# Altium schematic sheet MCU.SchDoc
size A4; SheetNumber: 3; SheetTotal: 6
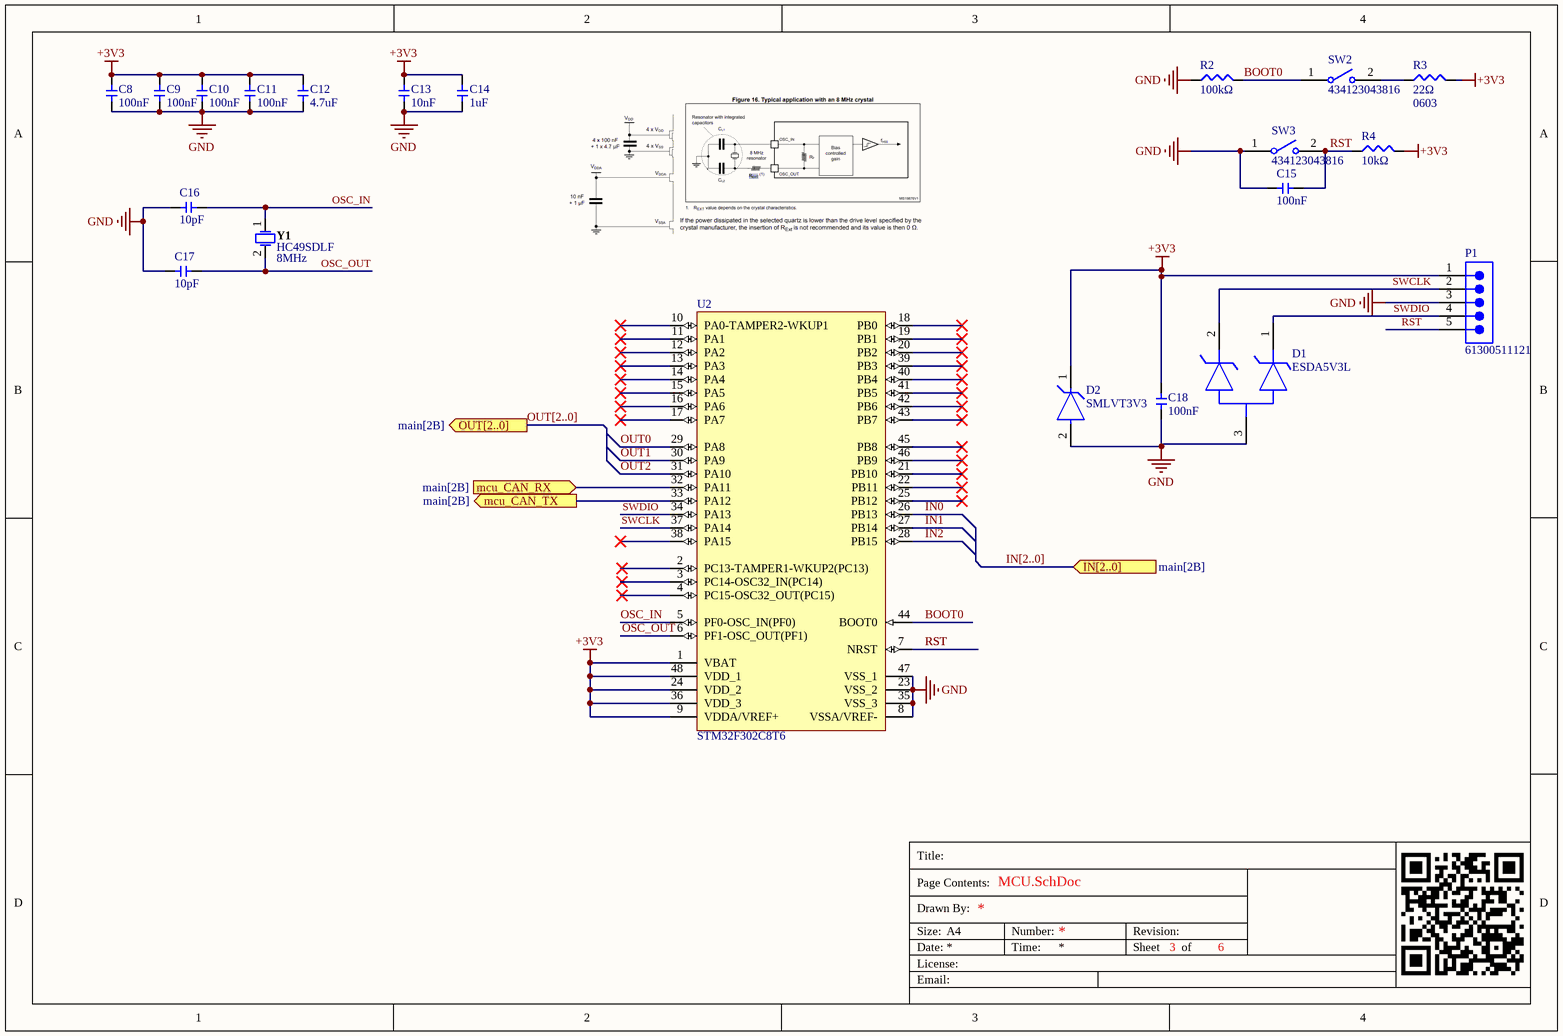
[diagram p0: MCU.SchDoc]

## Parts
C8  value 100nF  [0603_cap]  (hidden comment: 0603_100nF)
C9  value 100nF  [0603_cap]  (hidden comment: 0603_100nF)
C10  value 100nF  [0603_cap]  (hidden comment: 0603_100nF)
C11  value 100nF  [0603_cap]  (hidden comment: 0603_100nF)
C12  value 4.7uF  [0603_cap]  (hidden comment: 0603_4.7uF)
C13  value 10nF  [0603_cap]  (hidden comment: 0603_10nF)
C14  value 1uF  [0603_cap]  (hidden comment: 0603_1uF)
C15  value 100nF  [0603_cap]  (hidden comment: 0603_100nF)
C16  value 10pF  [0603_cap]  (hidden comment: 0603_10pF)
C17  value 10pF  [0603_cap]  (hidden comment: 0603_10pF)
C18  value 100nF  [0603_cap]  (hidden comment: 0603_100nF)
D1  ESDA5V3L  [FP-SOT23-3L-0053390-MFG]
D2  SMLVT3V3  [FP-SMB-MFG]
P1  61300511121  [61300511121]
R2  value 100kΩ  [0603-smd]  (hidden comment: 0603_100K)
R3  value 22Ω  Package: 0603  [0603-smd]  (hidden comment: 0603_22R)
R4  value 10kΩ  [0603-smd]  (hidden comment: 0603_10K)
SW2  434123043816  [WS-TASV_L6W3.5H4.3_4341x30438x6]
SW3  434123043816  [WS-TASV_L6W3.5H4.3_4341x30438x6]
U2  STM32F302C8T6  [STM-LQFP48_L]
Y1  Package Reference: HC49SDLF  Frequency: 8MHz  [FOX-HC49SDLF_V]  (hidden comment: FOXSDLF/080-20)

## Ports
IN[2..0] (in, see main[2B]), mcu_CAN_RX (in, see main[2B]), mcu_CAN_TX (out, see main[2B]), OUT[2..0] (out, see main[2B])

## Nets
+3V3: C8.2 C9.2 C10.2 C11.2 C12.2 C13.2 C14.2 C18.2 D2.1(K) P1.1 R3.2 R4.1 U2.1(VBAT) U2.9(VDDA/VREF+) U2.24(VDD_2) U2.36(VDD_3) U2.48(VDD_1)
GND: C8.1 C9.1 C10.1 C11.1 C12.1 C13.1 C14.1 C15.1 C16.1 C17.1 C18.1 D1.3(COMMON_ANODE) D2.2(A) P1.3 R2.2 SW3.1 U2.8(VSSA/VREF-) U2.23(VSS_2) U2.35(VSS_3) U2.47(VSS_1)
BOOT0: R2.1 SW2.1 U2.44(BOOT0)
IN0: U2.26(PB13)
IN1: U2.27(PB14)
IN2: U2.28(PB15)
mcu_CAN_RX: U2.32(PA11) ; port mcu_CAN_RX
mcu_CAN_TX: U2.33(PA12) ; port mcu_CAN_TX
OSC_IN: C16.2 U2.5(PF0-OSC_IN(PF0)) Y1.1
OSC_OUT: C17.2 U2.6(PF1-OSC_OUT(PF1)) Y1.2
OUT0: U2.29(PA8)
OUT1: U2.30(PA9)
OUT2: U2.31(PA10)
RST: C15.2 P1.5 R4.2 SW3.2 U2.7(NRST)
SWCLK: D1.2(2_CATHODE) P1.2 U2.37(PA14)
SWDIO: D1.1(1_CATHODE) P1.4 U2.34(PA13)
NetR3_1: R3.1 SW2.2

Not connected (* = marked no-connect by the designer): U2 2(PC13-TAMPER1-WKUP2(PC13))* 3(PC14-OSC32_IN(PC14))* 4(PC15-OSC32_OUT(PC15))* 10(PA0-TAMPER2-WKUP1)* 11(PA1)* 12(PA2)* 13(PA3)* 14(PA4)* 15(PA5)* 16(PA6)* 17(PA7)* 18(PB0)* 19(PB1)* 20(PB2)* 21(PB10)* 22(PB11)* 25(PB12)* 38(PA15)* 39(PB3)* 40(PB4)* 41(PB5)* 42(PB6)* 43(PB7)* 45(PB8)* 46(PB9)*

## Buses and harness runs
bus IN[2..0] = port IN[2..0]
bus OUT[2..0] = port OUT[2..0]

## Notes on the sheet
- Title:
- Drawn By:
- Page Contents:
- Size:
- Date:
- License:
- Email:
- A4
- Number:
- Time:
- Revision:
- Sheet
- of

## Library data of the parts
C8-C11 C15 C18 = 0603_100nF: Volt: V; Package: 0603
C12 = 0603_4.7uF: Volt: 25V; Package: 0603
C13 = 0603_10nF: Volt: V; Package: 0603
C14 = 0603_1uF: Volt: V; Package: 0603
C16 C17 = 0603_10pF: Volt: V; Package: 0603
D1 = CMP-12225-000053-1: TVS DIODE 3V SOT23-3; Manufacturer: STMicroelectronics; Capacitance: 220pF; Peak Pulse Power: 300W; Value: 220pF; Max Junction Temp: +150°C; Standoff Height: 0mm; Peak Pulse Current: 25A; Direction: Unidirectional; Number Of Channels: 2; Breakdown Voltage: 5.3V; Mouser Description: ESDA Series 2 Channel 5.3 V 220 pF SMT Uni-Directional Transil? Array - SOT-23; Device Class L2: TVS Diodes; Ipc Land Pattern Name: SOT95P255X115-3; Manufacturer Part Number: ESDA5V3L; Temperature Range Low: -40°C; Device Class L3: unset; Height: 1.4mm; Lead Free: Yes; ComponentLink2URL: https://www.st.com/content/ccc/resource/technical/document/datasheet/eb/9f/a7/ac/7b/b6/46/7f/CD00002057.pdf/files/CD00002057.pdf/jcr:content/translations/en.CD00002057.pdf; Category: Diode; Temperature: -40°C to +150°C; Automotive: No; Package: SOT23-3L-0053390; Digikey Description: TVS DIODE 3V SOT23-3; Reverse Standoff Voltage: 3V; Octopart: https://octopart.com/esda5v3l-stmicroelectronics-347708; Device Class L1: Circuit Protection; Temperature Range High: +150°C; RoHS: TRUE; ComponentLink2Description: Datasheet
D2 = CMP-2000-07127-2: TVS DIODE 3.3V 10.3V SMB; Manufacturer: STMicroelectronics; Standoff Height: 0.05mm; Max Junction Temp: +175°C; Capacitance: 5200pF; Breakdown Voltage: 4.1V; Peak Pulse Power: 600W; Clamping Voltage: 7.3V; Direction: Unidirectional; Number Of Channels: 1; Peak Pulse Current: 50A; Value: 5200pF; ComponentLink2Description: Datasheet; Digikey Description: TVS DIODE 3.3V 10.3V SMB; Automotive: No; Temperature Range Low: -55°C; Device Class L2: TVS Diodes; RoHS: TRUE; ComponentLink2URL: https://www.st.com/resource/en/datasheet/smlvt3v3.pdf; Temperature: -55°C to +175°C; Device Class L3: unset; Package: SMB; Lead Free: Yes; Mouser Description: TVS Diodes - Transient Voltage Suppressors 600W 3.3V Unidirect; Height: 2.65mm; Octopart: https://octopart.com/smlvt3v3-stmicroelectronics-347049; Temperature Range High: +175°C; Category: Diode; Manufacturer Part Number: SMLVT3V3; Device Class L1: Circuit Protection
P1 = CMP-1502-01068-3: NexarPartId: 32855526; Connector Type: Male Pin; Gender: Male; Contact Resistance: 20mΩ; Pitch: 2.54mm; Operating Supply Voltage: 250V; Current Rating: 3A; Number of Contacts: 5; Lead Free: Lead Free; Color: Black; Packaging: Bulk; Lead Pitch: 2.54mm; Contact Material: Copper; Min Operating Temperature: -40°C; Contact Mating Length: 5.9944mm; Voltage Rating: 250V; Number of Pins: 5; Number of Positions: 5; Height: 8.89mm; Orientation: Vertical; REACH SVHC: Unknown; RoHS: Compliant; Contact Plating: Gold; Max Operating Temperature: 105°C; Mount: Through Hole; Number of Rows: 1; Termination: Solder
R2 = 0603_100K: Power: W; Package: 0603
R3 = 0603_22R: Power: W
R4 = 0603_10K: Power: W; Package: 0603
SW2 SW3 = CMP-1460-00005-2: NexarPartId: 22866049; Current Rating: 50mA; Voltage Rating: 12V; Insulation Resistance: 100MΩ; Packaging: Tape and Reel; Min Operating Temperature: -40°C; Contact Current Rating: 50mA; RoHS: Compliant; Height: 4.3mm; Contact Plating: Silver; Color: Black; Width: 6mm; Contact Resistance: 100mΩ; Max Operating Temperature: 85°C
U2 = CMP-0537-00011-1: ARM Cortex-M4 32-bit MCU, 64 KB Flash, 16 KB Internal RAM, 37 I/Os, 48-Pin LQFP, -40 to 85 degC, Tray; Operating Frequency(F) (Processor speed) (MHz): 72; Internal RAM Size (kB): 16; D/A Converter: 1; FLASH Size (Prog) (kB): 64; I/Os (High Current): 37; Supply Voltage(Vcc) min (V): 2; ComponentLink2Description: Datasheet; Package Reference: LQFP48; Package Description: 48-Pin Low Profile Quad Flat Package, Body 7 x 7 mm, Pitch 0.5 mm; Packing: Tray; ComponentLink1URL: http://www.st.com/; ComponentLink1Description: Manufacturer URL; DatasheetVersion: Rev. 5; Core: ARM Cortex-M4; Mounting Technology: Surface Mount; ComponentLink2URL: http://www.st.com/st-web-ui/static/active/en/resource/technical/document/datasheet/DM00093333.pdf
Y1 = CMP-2100-03639-1: Resistance Weld Crystal, 8 MHz, +/- 30 ppm, -20 to 70 degC, 2-Pin SMD, RoHS, Tape and Reel; Manufacturer: FOX Electronics; Series Resistance: 80Ohm; Load Capacitance: 20pF; Tolerance: 50ppm; Frequency Tolerance: 30ppm; Datasheet URL: http://www.foxonline.com/pdfs/hc49sdlf.pdf; Height: 4.5mm; Mount: SurfaceMount; Packaging: TapeandReel; Length: 11.7mm; Termination: SMD/SMT; Number of Pins: 2; Depth: 5mm; Min Operating Temperature: -20degC; Package Quantity: 1000; RoHSCompliant: True; Lead Free: LeadFree; Width: 5mm; Case/Package: SMD/SMT; Manufacturer URL: http://www.foxonline.com/; Max Operating Temperature: 70degC; REACH SVHC: NoSVHC; Datasheet Version: 42064.0; Package Description: 2-Pin Surface Mount Device, Body 5 x 11.7 mm; Frequency Stability: 50ppm; ESR (Equivalent Series Resistance): 80Ohm; Radiation Hardening: No